# EAGLE schematic cansat_vehicle_v3_brd1 (EAGLE 7.1.0)
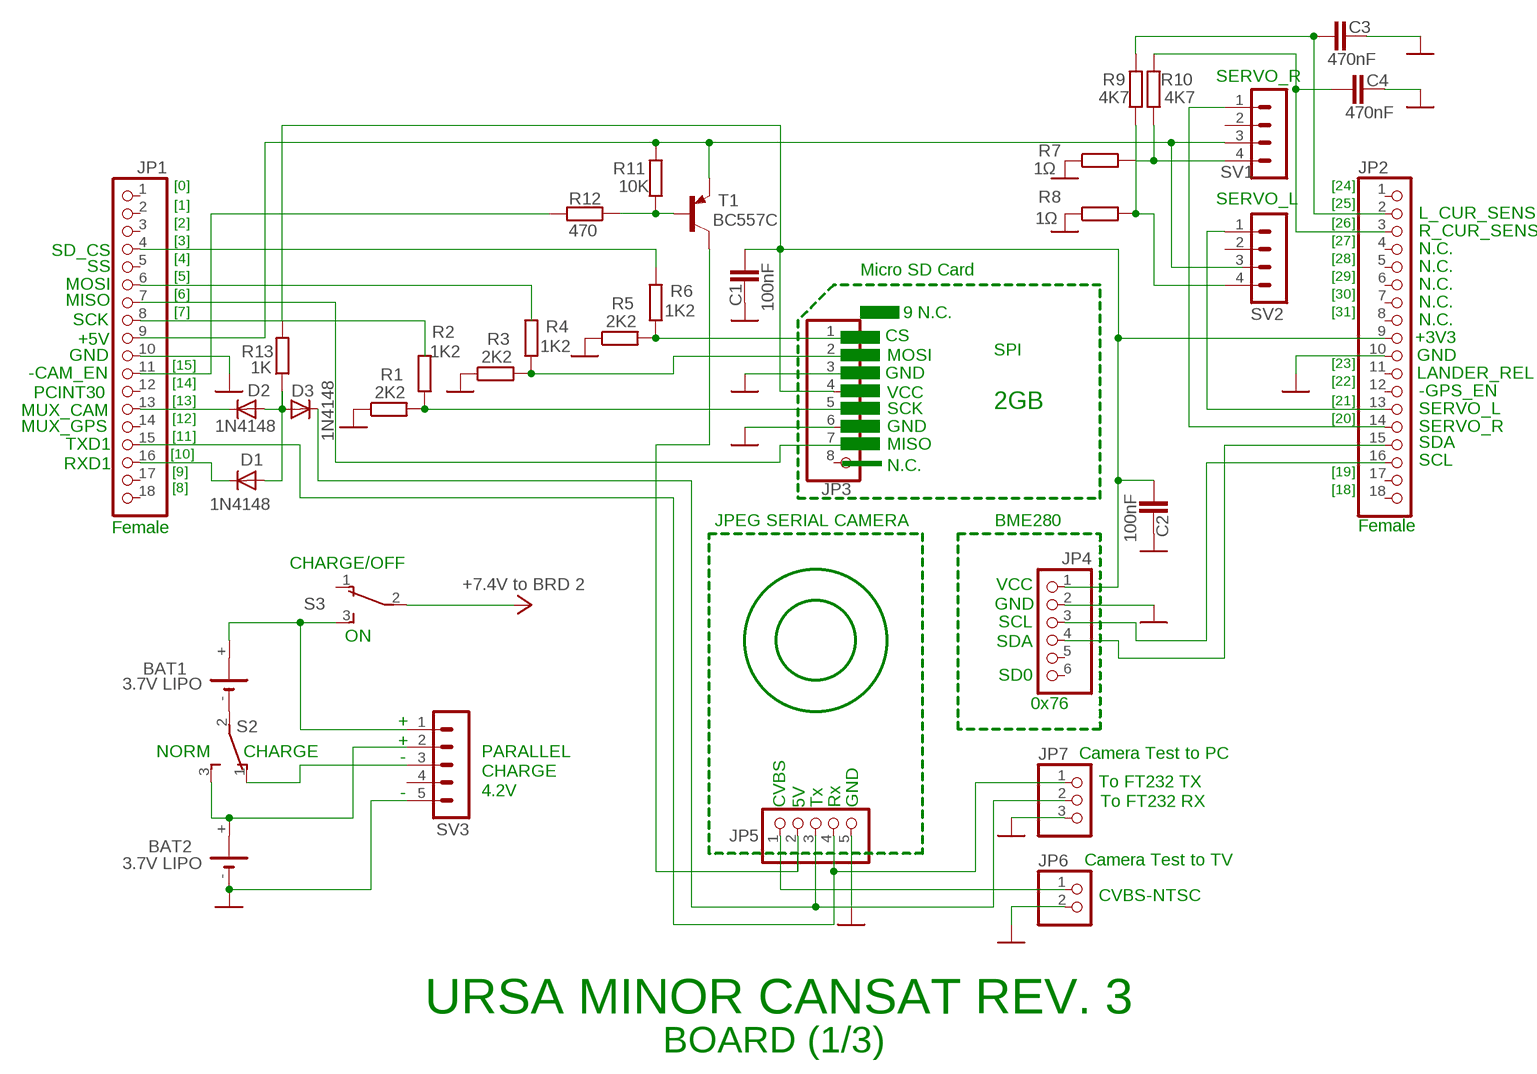
[diagram p0: schematic, sheet 1]

## Parts
BAT1  3.7V LIPO  CR-AA  [CRAA]
BAT2  3.7V LIPO  CR-AA  [CRAA]
C1  100nF  C2.5/2  [C2.5-2]
C2  100nF  C2.5/2  [C2.5-2]
C3  470nF  C2.5/2  [C2.5-2]
C4  470nF  C2.5/2  [C2.5-2]
D1  1N4148  1N4148DO35-10  [DO35-10]
D2  1N4148  1N4148DO35-10  [DO35-10]
D3  1N4148  1N4148DO35-10  [DO35-10]
JP1  PINHD-1X18  [1X18]
JP2  PINHD-1X18  [1X18]
JP3  PINHD-1X8  [1X08]
JP4  PINHD-1X6  [1X06]
JP5  PINHD-1X5  [1X05]
JP6  PINHD-1X2  [1X02]
JP7  PINHD-1X3  [1X03]
R1  2K2  R-EU_0204_2V  [0204V]
R2  1K2  R-EU_0204_2V  [0204V]
R3  2K2  R-EU_0204_2V  [0204V]
R4  1K2  R-EU_0204_2V  [0204V]
R5  2K2  R-EU_0204_2V  [0204V]
R6  1K2  R-EU_0204_2V  [0204V]
R7  1Ω  R-EU_0204_2V  [0204V]
R8  1Ω  R-EU_0204_2V  [0204V]
R9  4K7  R-EU_0204_2V  [0204V]
R10  4K7  R-EU_0204_2V  [0204V]
R11  10K  R-EU_0204_2V  [0204V]
R12  470  R-EU_0204_2V  [0204V]
R13  1K  R-EU_0204_2V  [0204V]
S2  TL36WO  [TL3XWO]
S3  TL36WO  [TL3XWO]
SV1  MA04-1  [MA04-1]
SV2  MA04-1  [MA04-1]
SV3  MA05-1  [MA05-1]
T1  BC557C  -PNP-TO92  [TO92]

## Nets
GND: BAT2.- C1.2 C2.2 C3.2 C4.2 JP1.10 JP2.10 JP3.3 JP3.6 JP4.2 JP5.5 JP6.2 JP7.3 R1.1 R3.1 R5.1 R7.1 R8.1 SV3.5
N$1: C1.1 C2.1 JP1.8 JP2.9 JP3.4 JP4.1 R13.2
N$2: JP2.15 JP4.4
N$3: R7.2 R10.1 SV1.4
N$4: JP1.6
N$6: R8.2 R9.1 SV2.4
N$7: C3.1 JP2.2 R9.2
N$8: C4.1 JP2.3 R10.2
N$9: JP5.2
N$10: R11.1 R12.1 T1.2(B)
N$11: JP1.11 R12.2
N$12: D1.C JP1.16
N$13: D2.C JP1.13
N$15: D1.A D2.A D3.A R13.1
N$49: JP3.1 R5.2 R6.1
N$50: JP1.4 R6.2
N$51: JP3.2 R3.2 R4.1
N$53: JP3.5 R1.2 R2.1
N$54: JP2.13 SV2.1
N$55: JP1.7 JP3.7
N$56: JP2.14 SV1.1
N$58: JP2.16 JP4.3
N$59: JP1.9 R11.2 SV1.3 SV2.3 T1.1(E)
N$61: BAT1.- S2.2(P)
N$62: BAT2.+ S2.3(S) SV3.2
N$63: BAT1.+ S3.3(S) SV3.1
N$64: S2.1(O) SV3.3
N$65: T1.3(C)
N$66: JP5.1 JP6.1
N$68: D3.C JP5.3 JP7.2
N$69: JP1.15 JP5.4 JP7.1
VCC: S3.2(P) ; supply symbol labelled +7.4V to BRD 2
Unconnected: BAT1.+@1(+) BAT2.+@1(+) JP1.1 JP1.2 JP1.3 JP1.5 JP1.12 JP1.14 JP1.17 JP1.18 JP2.1 JP2.4 JP2.5 JP2.6 JP2.7 JP2.8 JP2.11 JP2.12 JP2.17 JP2.18 JP3.8 JP4.5 JP4.6 R2.2 R4.2 S3.1(O) SV1.2 SV2.2 SV3.4

## Notes on the sheet
- SERVO_R
- [0] | [24]
- SERVO_L | [25]
- [1]
- L_CUR_SENS
- [2] | [26]
- R_CUR_SENS
- [3] | [27]
- SD_CS | N.C.
- [4] | [28]
- SS | Micro SD Card | N.C.
- [5] | [29]
- MOSI | N.C.
- [6] | [30]
- MISO | N.C.
- [7] | 9 N.C. | [31]
- SCK | N.C.
- +5V | CS | +3V3
- SPI
- GND | MOSI | GND
- [15] | [23]
- -CAM_EN | GND | LANDER_REL
- [14] | [22]
- PCINT30 | VCC | -GPS_EN
- [13] | 2GB | [21]
- MUX_CAM | SCK | SERVO_L
- [12] | [20]
- MUX_GPS | GND | SERVO_R
- [11]
- TXD1 | MISO | SDA
- [10]
- RXD1 | SCL
- N.C.
- [9] | [19]
- [8] | [18]
- JPEG SERIAL CAMERA | BME280
- Female | Female
- CHARGE/OFF
- VCC
- GND
- SCL
- ON
- SDA
- SD0
- 0x76
- +
- +
- NORM | CHARGE | PARALLEL | Camera Test to PC
- -
- CHARGE
- To FT232 TX
- - | 4.2V
- CVBS | 5V | Tx | Rx | GND | To FT232 RX
- Camera Test to TV
- CVBS-NTSC
- URSA MINOR CANSAT REV. 3
- BOARD (1/3)

## Library data of the parts
BAT1 BAT2 = battery:CR-AA: LI BATTERY Varta CRAA-SLF
C1-C4 = capacitor-wima:C: CAPACITOR naming: grid - package width
D1-D3 = diode:1N4148: DIODE high speed (Philips)
JP1 JP2 = pinhead:PINHD-1X18: PIN HEADER
JP3 = pinhead:PINHD-1X8: PIN HEADER
JP4 = pinhead:PINHD-1X6: PIN HEADER
JP5 = pinhead:PINHD-1X5: PIN HEADER
JP6 = pinhead:PINHD-1X2: PIN HEADER
JP7 = pinhead:PINHD-1X3: PIN HEADER
R1-R13 = resistor:R-EU_: RESISTOR, European symbol; SPICEPREFIX: R
S2 S3 = switch:TL36WO: TINY SWITCH ON - ON Source: http://www2.produktinfo.conrad.com/datenblaetter/700000-724999/705152-da-01-de-Subminiaturschalter_TL_36WO.pdf
SV1 SV2 = con-lstb:MA04-1: PIN HEADER; OC_FARNELL: unknown; OC_NEWARK: unknown
SV3 = con-lstb:MA05-1: PIN HEADER; OC_FARNELL: unknown; OC_NEWARK: unknown
T1 = transistor-neu-to92:*-PNP-: PNP Transistror